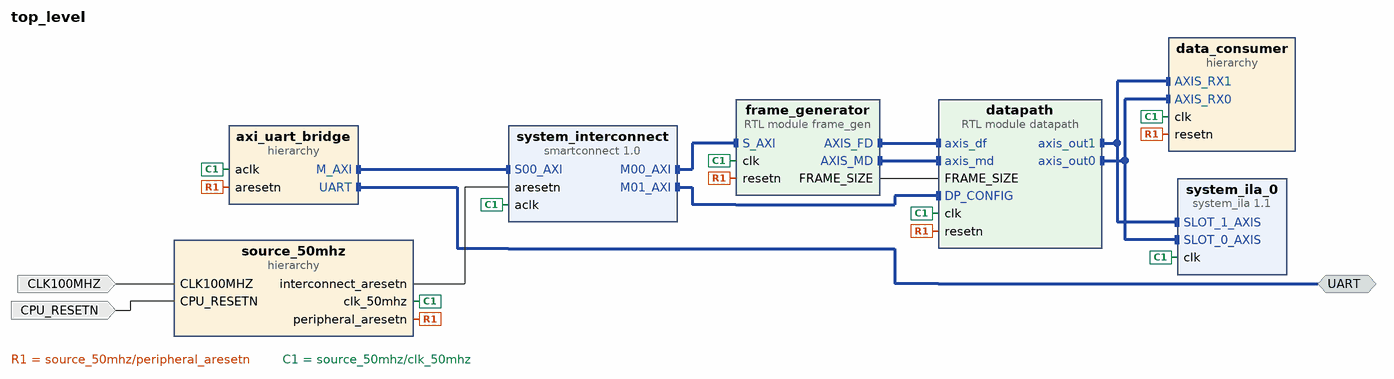
[diagram p0: block diagram of the top level]
# Vivado block design top_level, xc7a100tcsg324-1, Vivado 2021.1.1
create_bd_design top_level

create_bd_intf_port -mode Master -vlnv xilinx.com:interface:uart_rtl:1.0 UART
create_bd_port -dir I -type clk CLK100MHZ
set_property -dict {CONFIG.ASSOCIATED_RESET CPU_RESETN} [get_bd_ports CLK100MHZ]
create_bd_port -dir I -type rst CPU_RESETN

create_bd_cell -type hier source_50mhz
create_bd_cell -type hier axi_uart_bridge
create_bd_cell -type ip -vlnv xilinx.com:ip:smartconnect:1.0 system_interconnect
set_property -dict {CONFIG.NUM_MI 2 CONFIG.NUM_SI 1} [get_bd_cells system_interconnect]
create_bd_cell -type ip -vlnv xilinx.com:ip:system_ila:1.1 system_ila_0
set_property -dict [list \
  CONFIG.C_NUM_MONITOR_SLOTS 2 \
  CONFIG.C_SLOT 1 \
  CONFIG.C_SLOT_0_INTF_TYPE xilinx.com:interface:axis_rtl:1.0 \
  CONFIG.C_SLOT_1_INTF_TYPE xilinx.com:interface:axis_rtl:1.0 \
] [get_bd_cells system_ila_0]
create_bd_cell -type module -reference frame_gen frame_generator
create_bd_cell -type hier data_consumer
create_bd_cell -type module -reference datapath datapath

# ---- hierarchy /source_50mhz ----
current_bd_instance /source_50mhz
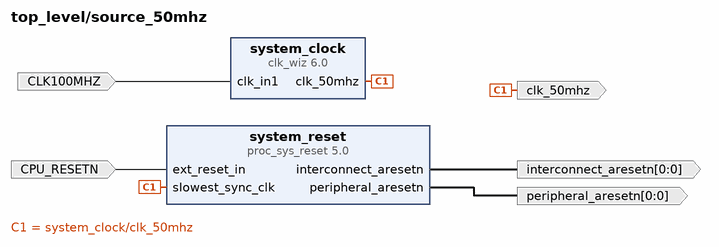
[diagram p1: block diagram inside /source_50mhz]
create_bd_pin -dir I -type clk CLK100MHZ
create_bd_pin -dir O -type clk clk_50mhz
create_bd_pin -dir I -type rst CPU_RESETN
create_bd_pin -dir O -from 0 -to 0 -type rst interconnect_aresetn
create_bd_pin -dir O -from 0 -to 0 -type rst peripheral_aresetn

create_bd_cell -type ip -vlnv xilinx.com:ip:clk_wiz:6.0 system_clock
set_property -dict [list \
  CONFIG.CLKOUT1_DRIVES BUFGCE \
  CONFIG.CLKOUT1_JITTER 151.636 \
  CONFIG.CLKOUT1_REQUESTED_OUT_FREQ 50 \
  CONFIG.CLKOUT2_DRIVES BUFGCE \
  CONFIG.CLKOUT3_DRIVES BUFGCE \
  CONFIG.CLKOUT4_DRIVES BUFGCE \
  CONFIG.CLKOUT5_DRIVES BUFGCE \
  CONFIG.CLKOUT6_DRIVES BUFGCE \
  CONFIG.CLKOUT7_DRIVES BUFGCE \
  CONFIG.CLK_OUT1_PORT clk_50mhz \
  CONFIG.FEEDBACK_SOURCE FDBK_AUTO \
  CONFIG.MMCM_CLKOUT0_DIVIDE_F 20.000 \
  CONFIG.USE_LOCKED false \
  CONFIG.USE_RESET false \
  CONFIG.USE_SAFE_CLOCK_STARTUP true \
] [get_bd_cells system_clock]
create_bd_cell -type ip -vlnv xilinx.com:ip:proc_sys_reset:5.0 system_reset

# ---- hierarchy /axi_uart_bridge ----
current_bd_instance /axi_uart_bridge
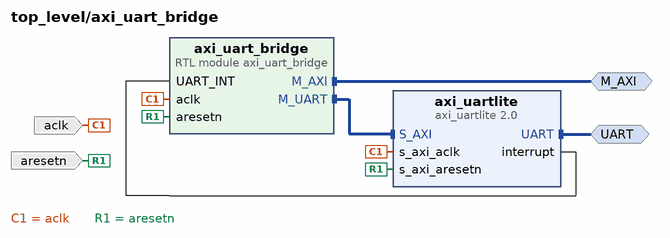
[diagram p2: block diagram inside /axi_uart_bridge]
create_bd_intf_pin -mode Master -vlnv xilinx.com:interface:aximm_rtl:1.0 M_AXI
create_bd_intf_pin -mode Master -vlnv xilinx.com:interface:uart_rtl:1.0 UART
create_bd_pin -dir I -type rst aresetn
create_bd_pin -dir I -type clk aclk

create_bd_cell -type module -reference axi_uart_bridge axi_uart_bridge
create_bd_cell -type ip -vlnv xilinx.com:ip:axi_uartlite:2.0 axi_uartlite
set_property -dict {CONFIG.C_BAUDRATE 115200} [get_bd_cells axi_uartlite]

# ---- hierarchy /data_consumer ----
current_bd_instance /data_consumer
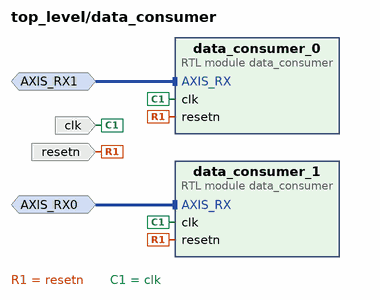
[diagram p3: block diagram inside /data_consumer]
create_bd_intf_pin -mode Slave -vlnv xilinx.com:interface:axis_rtl:1.0 AXIS_RX0
create_bd_intf_pin -mode Slave -vlnv xilinx.com:interface:axis_rtl:1.0 AXIS_RX1
create_bd_pin -dir I -type clk clk
create_bd_pin -dir I -type rst resetn

create_bd_cell -type module -reference data_consumer data_consumer_1
set_property -dict {CONFIG.NREADY_CYCLES 4 CONFIG.READY_CYCLES 12} [get_bd_cells data_consumer_1]
create_bd_cell -type module -reference data_consumer data_consumer_0
set_property -dict {CONFIG.NREADY_CYCLES 4 CONFIG.READY_CYCLES 12} [get_bd_cells data_consumer_0]

# ---- connections ----

current_bd_instance /source_50mhz
connect_bd_net [get_bd_pins CLK100MHZ] [get_bd_pins system_clock/clk_in1]
connect_bd_net [get_bd_pins CPU_RESETN] [get_bd_pins system_reset/ext_reset_in]
connect_bd_net -net system_clock_clk_100mhz [get_bd_pins system_clock/clk_50mhz] [get_bd_pins clk_50mhz] [get_bd_pins system_reset/slowest_sync_clk]
connect_bd_net [get_bd_pins system_reset/interconnect_aresetn] [get_bd_pins interconnect_aresetn]
connect_bd_net [get_bd_pins system_reset/peripheral_aresetn] [get_bd_pins peripheral_aresetn]

current_bd_instance /axi_uart_bridge
connect_bd_intf_net [get_bd_intf_pins M_AXI] [get_bd_intf_pins axi_uart_bridge/M_AXI]
connect_bd_intf_net [get_bd_intf_pins UART] [get_bd_intf_pins axi_uartlite/UART]
connect_bd_intf_net [get_bd_intf_pins axi_uart_bridge/M_UART] [get_bd_intf_pins axi_uartlite/S_AXI]
connect_bd_net [get_bd_pins aclk] [get_bd_pins axi_uart_bridge/aclk] [get_bd_pins axi_uartlite/s_axi_aclk]
connect_bd_net [get_bd_pins aresetn] [get_bd_pins axi_uart_bridge/aresetn] [get_bd_pins axi_uartlite/s_axi_aresetn]
connect_bd_net [get_bd_pins axi_uartlite/interrupt] [get_bd_pins axi_uart_bridge/UART_INT]

current_bd_instance /data_consumer
connect_bd_intf_net -intf_net datapath_AXIS_OUT0 [get_bd_intf_pins AXIS_RX1] [get_bd_intf_pins data_consumer_0/AXIS_RX]
connect_bd_intf_net -intf_net datapath_AXIS_OUT1 [get_bd_intf_pins AXIS_RX0] [get_bd_intf_pins data_consumer_1/AXIS_RX]
connect_bd_net -net source_100mhz_peripheral_aresetn [get_bd_pins resetn] [get_bd_pins data_consumer_0/resetn] [get_bd_pins data_consumer_1/resetn]
connect_bd_net -net system_clock_clk_100mhz [get_bd_pins clk] [get_bd_pins data_consumer_0/clk] [get_bd_pins data_consumer_1/clk]

current_bd_instance /
connect_bd_intf_net [get_bd_intf_pins data_consumer/AXIS_RX1] [get_bd_intf_pins datapath/axis_out1]
connect_bd_intf_net [get_bd_intf_pins data_consumer/AXIS_RX1] [get_bd_intf_pins system_ila_0/SLOT_1_AXIS]
connect_bd_intf_net [get_bd_intf_pins data_consumer/AXIS_RX0] [get_bd_intf_pins datapath/axis_out0]
connect_bd_intf_net [get_bd_intf_pins data_consumer/AXIS_RX0] [get_bd_intf_pins system_ila_0/SLOT_0_AXIS]
connect_bd_intf_net [get_bd_intf_pins datapath/axis_df] [get_bd_intf_pins frame_generator/AXIS_FD]
connect_bd_intf_net [get_bd_intf_pins datapath/axis_md] [get_bd_intf_pins frame_generator/AXIS_MD]
connect_bd_intf_net -intf_net hier_0_M_AXI [get_bd_intf_pins system_interconnect/S00_AXI] [get_bd_intf_pins axi_uart_bridge/M_AXI]
connect_bd_intf_net -intf_net hier_0_UART [get_bd_intf_ports UART] [get_bd_intf_pins axi_uart_bridge/UART]
connect_bd_intf_net [get_bd_intf_pins frame_generator/S_AXI] [get_bd_intf_pins system_interconnect/M00_AXI]
connect_bd_intf_net [get_bd_intf_pins datapath/DP_CONFIG] [get_bd_intf_pins system_interconnect/M01_AXI]
connect_bd_net [get_bd_ports CLK100MHZ] [get_bd_pins source_50mhz/CLK100MHZ]
connect_bd_net [get_bd_ports CPU_RESETN] [get_bd_pins source_50mhz/CPU_RESETN]
connect_bd_net [get_bd_pins frame_generator/FRAME_SIZE] [get_bd_pins datapath/FRAME_SIZE]
connect_bd_net -net source_100mhz_interconnect_aresetn [get_bd_pins source_50mhz/interconnect_aresetn] [get_bd_pins system_interconnect/aresetn]
connect_bd_net -net source_100mhz_peripheral_aresetn [get_bd_pins source_50mhz/peripheral_aresetn] \
  [get_bd_pins axi_uart_bridge/aresetn] [get_bd_pins frame_generator/resetn] [get_bd_pins data_consumer/resetn] \
  [get_bd_pins datapath/resetn]
connect_bd_net -net system_clock_clk_100mhz [get_bd_pins source_50mhz/clk_50mhz] \
  [get_bd_pins axi_uart_bridge/aclk] [get_bd_pins system_interconnect/aclk] [get_bd_pins system_ila_0/clk] \
  [get_bd_pins frame_generator/clk] [get_bd_pins data_consumer/clk] [get_bd_pins datapath/clk]

# ---- address map ----
assign_bd_address -offset 0x0000000000001000 -range 256 -target_address_space [get_bd_addr_spaces axi_uart_bridge/axi_uart_bridge/M_AXI] [get_bd_addr_segs frame_generator/S_AXI/reg0]
assign_bd_address -offset 0x40600000 -range 64K -target_address_space [get_bd_addr_spaces axi_uart_bridge/axi_uart_bridge/M_UART] [get_bd_addr_segs axi_uart_bridge/axi_uartlite/S_AXI/Reg]

validate_bd_design
save_bd_design
